# Altium schematic sheet CAN.SchDoc
size A4; SheetNumber: 7; SheetTotal: 8
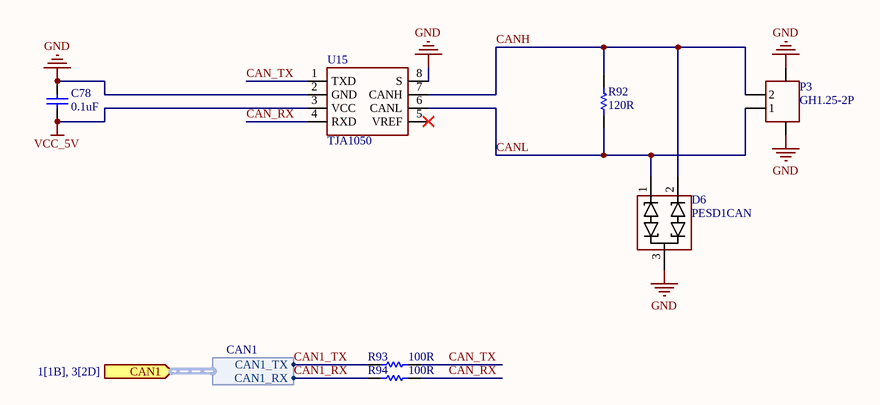
[diagram p0: CAN.SchDoc]

## Parts
C78  0.1uF  [C0603_NS]
D6  PESD1CAN  [SOT23-3N]
P3  GH1.25-2P  [A1257WR-S-2P]
R92  120R  [R0603_NS]
R93  100R  [R0603_NS]
R94  100R  [R0603_NS]
U15  TJA1050  [SOP8_N]

## Ports
CAN1 (in, harness CAN1, see 1[1B], 3[2D])

## Harnesses
CAN1: CAN1_RX, CAN1_TX

## Nets
GND: C78.2 D6.3 P3.0 U15.2(GND) U15.8(S)
VCC_5V: C78.1 U15.3(VCC)
CAN1_RX: R94.1 ; port CAN1.CAN1_RX
CAN1_TX: R93.1 ; port CAN1.CAN1_TX
CAN_RX: R94.2 U15.4(RXD)
CAN_TX: R93.2 U15.1(TXD)
CANH: D6.2 P3.2 R92.2 U15.7(CANH)
CANL: D6.1 P3.1 R92.1 U15.6(CANL)

Not connected (* = marked no-connect by the designer): U15 5(VREF)*

## Library data of the parts
C78 = Cap: Capacitor
P3 = Header2
R92-R94 = Res1: Resistor